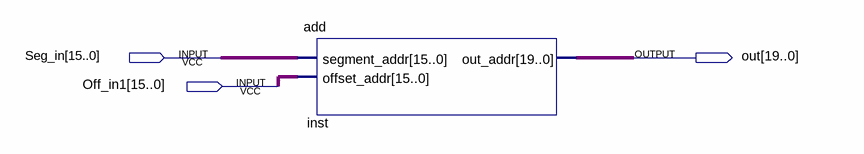
[diagram p0: schematic sheet]
// Quartus schematic transtophysics.bdf as structural Verilog: 1 symbols, 3 pins
module transtophysics (
  input  [15:0] Seg_in,
  input  [15:0] Off_in1,
  output [19:0] out
);

  add inst (.segment_addr(Seg_in), .offset_addr(Off_in1), .out_addr(out));
endmodule
